# EAGLE schematic adapters (EAGLE 7.4.0)
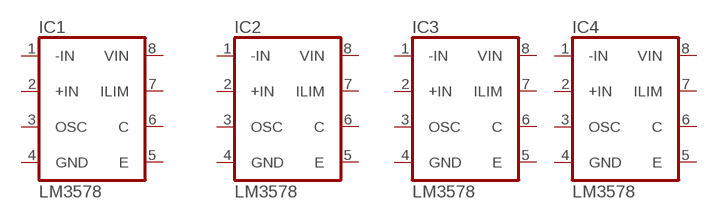
[diagram p0: schematic, sheet 1]

## Parts
IC1  LM3578  [DIP4-SMD]
IC2  LM3578  [DIP4-SMD]
IC3  LM3578  [DIP4-SMD]
IC4  LM3578  [DIP4-SMD]
Unconnected: IC1.1(-IN) IC1.2(+IN) IC1.3(OSC) IC1.4(GND) IC1.5(E) IC1.6(C) IC1.7(ILIM) IC2.1(-IN) IC2.2(+IN) IC2.3(OSC) IC2.4(GND) IC2.5(E) IC2.6(C) IC2.7(ILIM) IC3.1(-IN) IC3.2(+IN) IC3.3(OSC) IC3.4(GND) IC3.5(E) IC3.6(C) IC3.7(ILIM) IC4.1(-IN) IC4.2(+IN) IC4.3(OSC) IC4.4(GND) IC4.5(E) IC4.6(C) IC4.7(ILIM)

## Power pins joined to a net without a drawn wire
VIN: IC1.8(VIN) IC2.8(VIN) IC3.8(VIN) IC4.8(VIN)

## Library data of the parts
IC1-IC4 = adapter:LM3578